# Altium schematic sheet MCISO-S06-V00-HALL_DIFFB.SchDoc
size A4; SheetNumber: 7; SheetTotal: 8
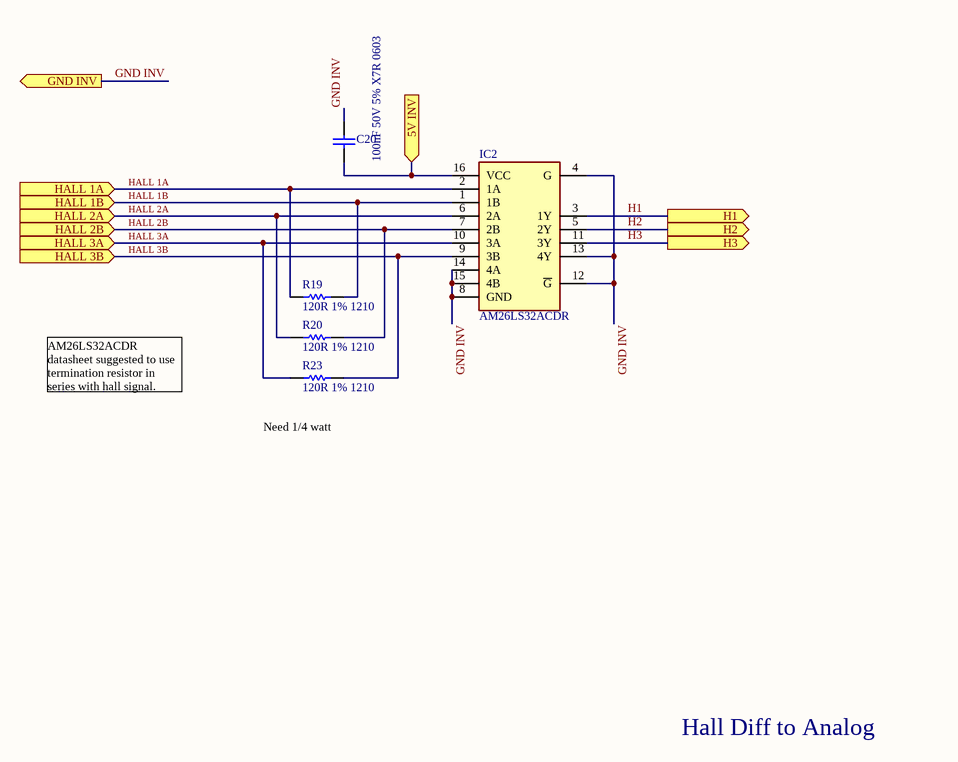
[diagram p0: MCISO-S06-V00-HALL_DIFFB.SchDoc]

## Parts
C20  100nF 50V 5% X7R 0603  [Cap_Ceramic_0603]
IC2  AM26LS32ACDR  [SOIC127P600X175-16N]
R19  120R 1% 1210  [Res_ThinFilm_1210]
R20  120R 1% 1210  [Res_ThinFilm_1210]
R23  120R 1% 1210  [Res_ThinFilm_1210]

## Ports
5V INV (in), GND INV (out), H1 (out), H2 (out), H3 (out), HALL 1A (in), HALL 1B (in), HALL 2A (in), HALL 2B (in), HALL 3A (in), HALL 3B (in)

## Nets
5V INV: C20.1 IC2.16(VCC) ; port 5V INV
GND INV: C20.2 IC2.4(G) IC2.8(GND) IC2.12(~{G}) IC2.13(4Y) IC2.14(4A) IC2.15(4B) ; port GND INV
H1: IC2.3(1Y) ; port H1
H2: IC2.5(2Y) ; port H2
H3: IC2.11(3Y) ; port H3
HALL 1A: IC2.2(1A) R19.1 ; port HALL 1A
HALL 1B: IC2.1(1B) R19.2 ; port HALL 1B
HALL 2A: IC2.6(2A) R20.1 ; port HALL 2A
HALL 2B: IC2.7(2B) R20.2 ; port HALL 2B
HALL 3A: IC2.10(3A) R23.1 ; port HALL 3A
HALL 3B: IC2.9(3B) R23.2 ; port HALL 3B

## Notes on the sheet
- AM26LS32ACDR datasheet suggested to use termination resistor in series with hall signal.
- (near R23) Need 1/4 watt
- Hall Diff to Analog

## Library data of the parts
C20 = 100nF 50V 5% X7R 0603: Capacitor, Ceramic, SMD, 100nF, 50V, 5%, X7R, 0603
IC2 = AM26LS32ACDR: Integrated Circuit; Manufacturer_Name: Texas Instruments; Datasheet Link: http://www.ti.com/lit/gpn/am26ls32ac; Height: 1.75mm; Manufacturer_Part_Number: AM26LS32ACDR; Mouser Part Number: 595-AM26LS32ACDR; Mouser Price/Stock: https://www.mouser.co.uk/ProductDetail/Texas-Instruments/AM26LS32ACDR/?qs=L4Mc90zKIpjEhSPPcfdoEw%3D%3D; Arrow Part Number: AM26LS32ACDR; Arrow Price/Stock: https://www.arrow.com/en/products/am26ls32acdr/texas-instruments
R19 R20 R23 = 120R 1% 1210: Resistor, SMD, 120R, 0.25W, 1%, 1210